# EAGLE design transmitter (EAGLE 7.7.0)
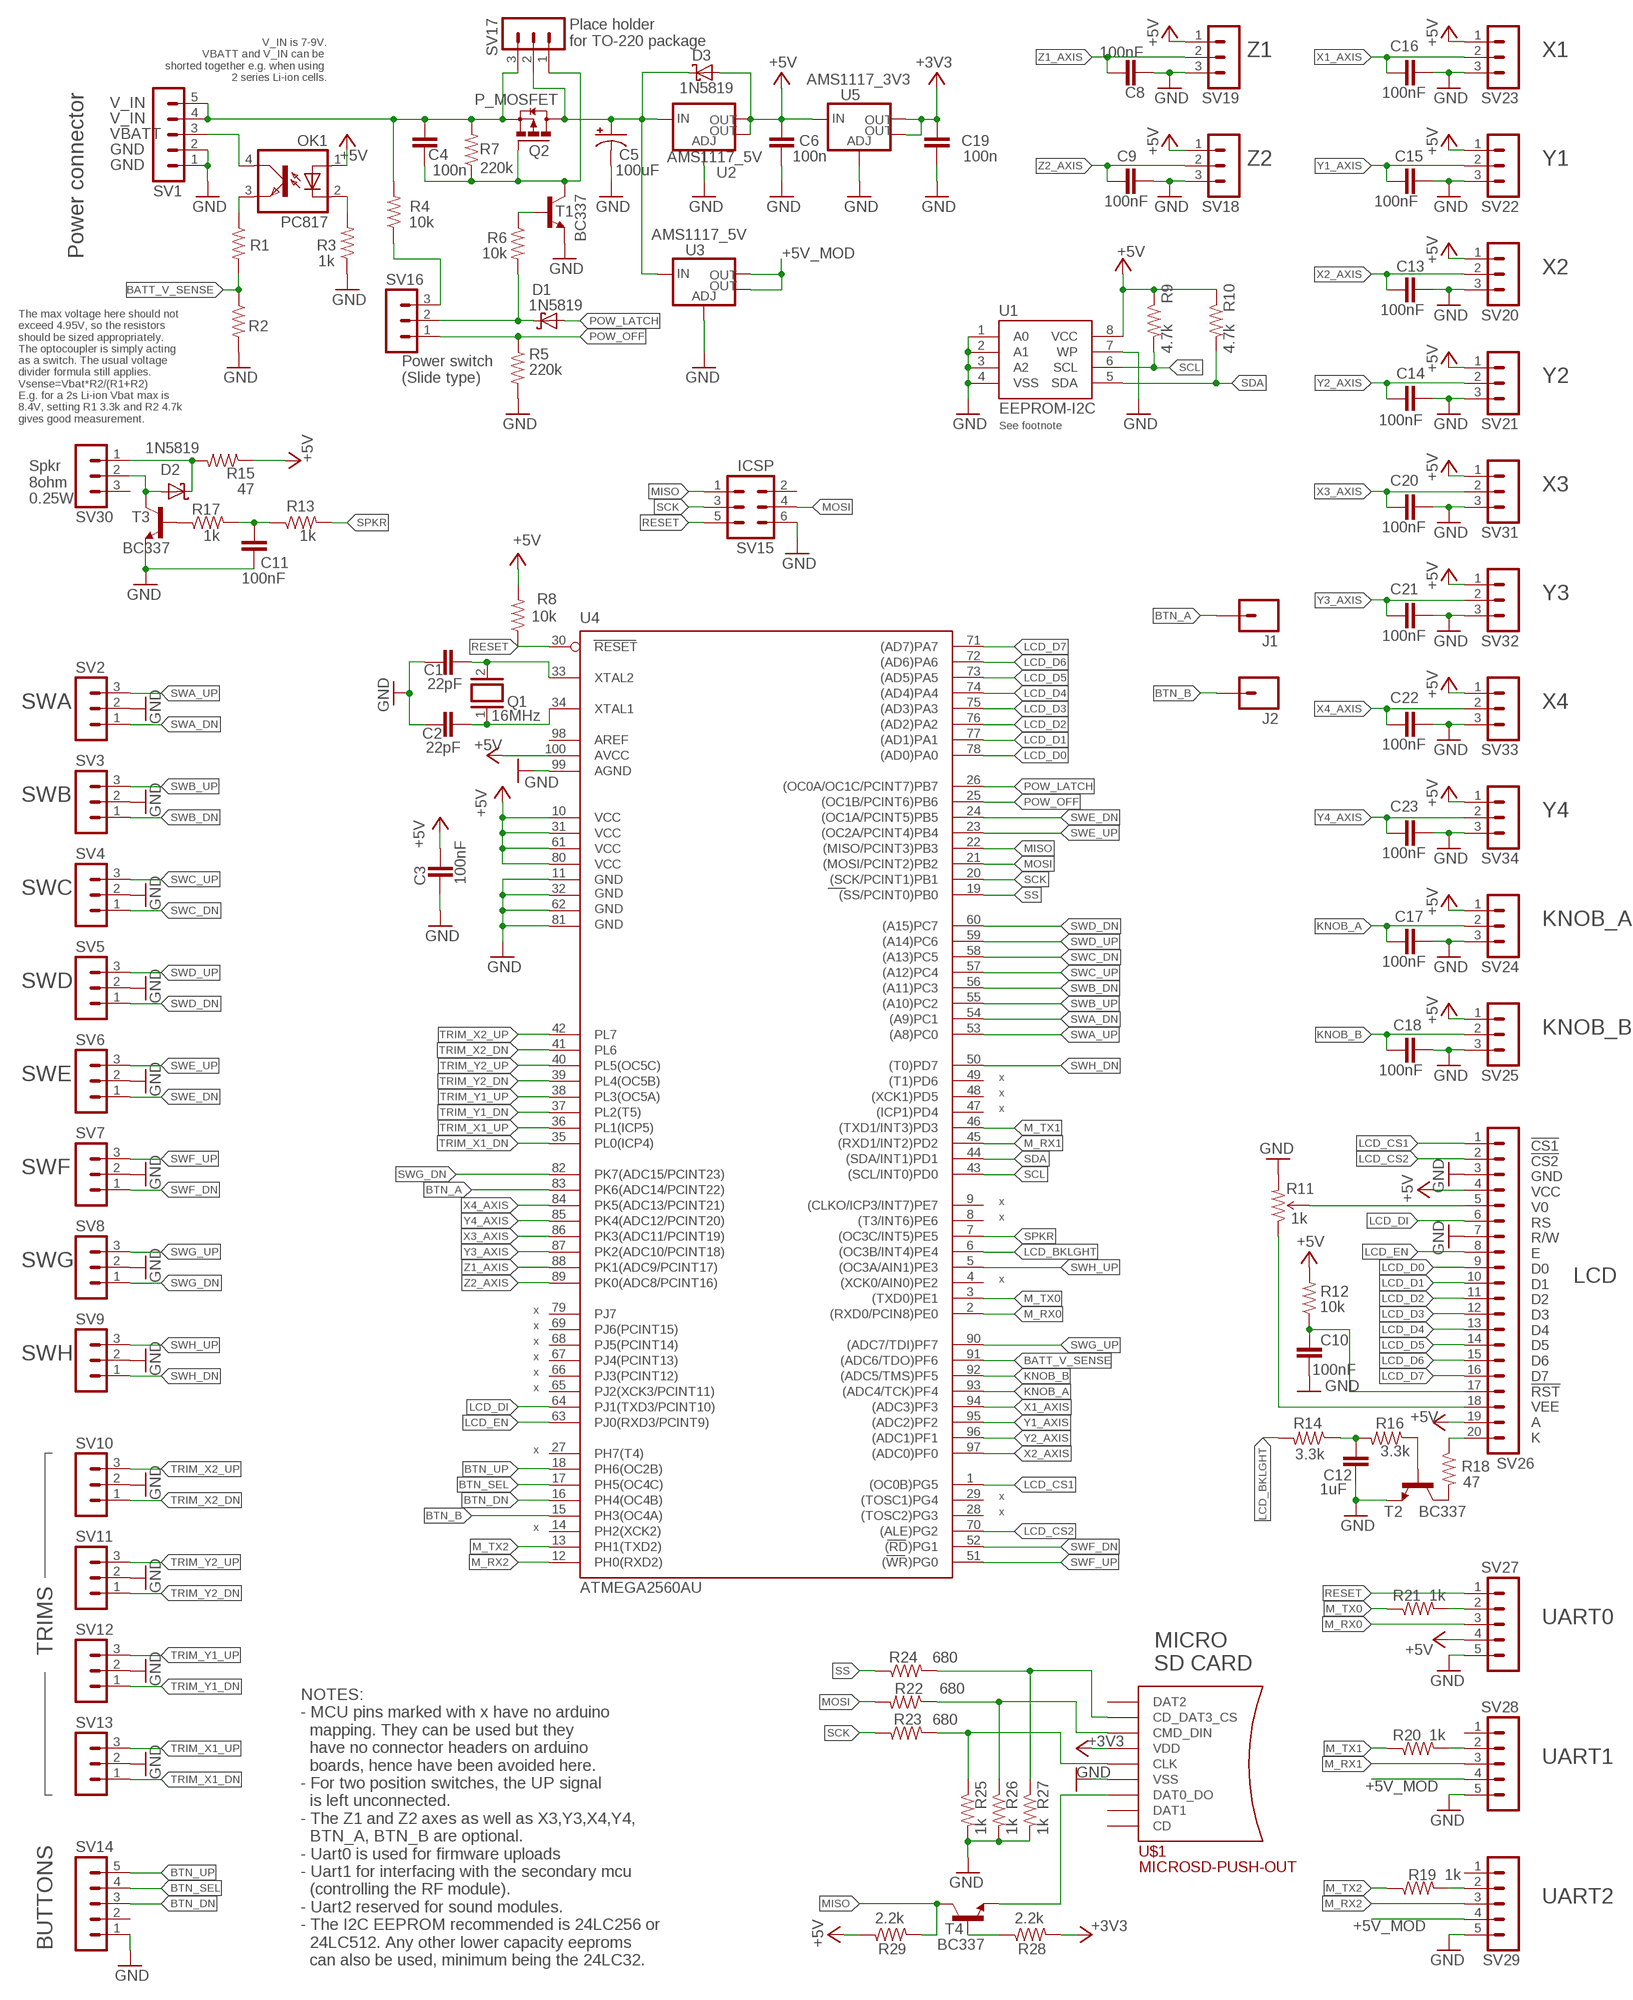
[diagram p0: schematic, sheet 1]

## Parts
C1  22pF  C-EU050-024X044  [C050-024X044]
C2  22pF  C-EU050-024X044  [C050-024X044]
C3  100nF  C-EU050-024X044  [C050-024X044]
C4  100n  C-EU050-024X044  [C050-024X044]
C5  100uF  CPOL-USE2,5-6E  [E2,5-6E]
C6  100n  C-EU050-024X044  [C050-024X044]
C8  100nF  C-EU050-024X044  [C050-024X044]
C9  100nF  C-EU050-024X044  [C050-024X044]
C10  100nF  C-EU050-024X044  [C050-024X044]
C11  100nF  C-EU050-024X044  [C050-024X044]
C12  1uF  C-EU050-024X044  [C050-024X044]
C13  100nF  C-EU050-024X044  [C050-024X044]
C14  100nF  C-EU050-024X044  [C050-024X044]
C15  100nF  C-EU050-024X044  [C050-024X044]
C16  100nF  C-EU050-024X044  [C050-024X044]
C17  100nF  C-EU050-024X044  [C050-024X044]
C18  100nF  C-EU050-024X044  [C050-024X044]
C19  100n  C-EU050-024X044  [C050-024X044]
C20  100nF  C-EU050-024X044  [C050-024X044]
C21  100nF  C-EU050-024X044  [C050-024X044]
C22  100nF  C-EU050-024X044  [C050-024X044]
C23  100nF  C-EU050-024X044  [C050-024X044]
D1  1N5819  1N5817-B  [DO41-7.6]
D2  1N5819  1N5817-B  [DO41-7.6]
D3  1N5819  1N5817-B  [DO41-7.6]
J1  M01PTH_LONGPAD  [1X01_LONGPAD]
J2  M01PTH_LONGPAD  [1X01_LONGPAD]
OK1  PC817  [DIL04]
Q1  16MHz  XTAL/S  [QS]
Q2  P_MOSFET  FDN360P  [SUPER-SOT3]
R1  1k  R-US_0204/5  [0204/5]
R2  1k  R-US_0204/5  [0204/5]
R3  1k  R-US_0204/5  [0204/5]
R4  10k  R-US_0204/5  [0204/5]
R5  220k  R-US_0204/5  [0204/5]
R6  10k  R-US_0204/5  [0204/5]
R7  220k  R-US_0204/5  [0204/5]
R8  10k  R-US_0204/5  [0204/5]
R9  4.7k  R-US_0204/5  [0204/5]
R10  4.7k  R-US_0204/5  [0204/5]
R11  1k  TRIMPOTPTH  [TRIM_POT_PTH]
R12  10k  R-US_0204/5  [0204/5]
R13  1k  R-US_0204/5  [0204/5]
R14  3.3k  R-US_0204/5  [0204/5]
R15  47  R-US_0204/5  [0204/5]
R16  3.3k  R-US_0204/5  [0204/5]
R17  1k  R-US_0204/5  [0204/5]
R18  47  R-US_0204/5  [0204/5]
R19  1k  R-US_0204/5  [0204/5]
R20  1k  R-US_0204/5  [0204/5]
R21  1k  R-US_0204/5  [0204/5]
R22  680  R-US_0204/5  [0204/5]
R23  680  R-US_0204/5  [0204/5]
R24  680  R-US_0204/5  [0204/5]
R25  1k  R-US_0204/5  [0204/5]
R26  1k  R-US_0204/5  [0204/5]
R27  1k  R-US_0204/5  [0204/5]
R28  2.2k  R-US_0204/5  [0204/5]
R29  2.2k  R-US_0204/5  [0204/5]
SV1  MA05-1  [MA05-1]
SV2  MA03-1  [MA03-1]
SV3  MA03-1  [MA03-1]
SV4  MA03-1  [MA03-1]
SV5  MA03-1  [MA03-1]
SV6  MA03-1  [MA03-1]
SV7  MA03-1  [MA03-1]
SV8  MA03-1  [MA03-1]
SV9  MA03-1  [MA03-1]
SV10  MA03-1  [MA03-1]
SV11  MA03-1  [MA03-1]
SV12  MA03-1  [MA03-1]
SV13  MA03-1  [MA03-1]
SV14  MA05-1  [MA05-1]
SV15  ICSP  MA03-2  [MA03-2]
SV16  MA03-1  [MA03-1]
SV17  MA03-1  [MA03-1]
SV18  MA03-1  [MA03-1]
SV19  MA03-1  [MA03-1]
SV20  MA03-1  [MA03-1]
SV21  MA03-1  [MA03-1]
SV22  MA03-1  [MA03-1]
SV23  MA03-1  [MA03-1]
SV24  MA03-1  [MA03-1]
SV25  MA03-1  [MA03-1]
SV26  MA20-1  [MA20-1]
SV27  MA05-1  [MA05-1]
SV28  MA05-1  [MA05-1]
SV29  MA05-1  [MA05-1]
SV30  MA03-1  [MA03-1]
SV31  MA03-1  [MA03-1]
SV32  MA03-1  [MA03-1]
SV33  MA03-1  [MA03-1]
SV34  MA03-1  [MA03-1]
T1  BC337  [TO92]
T2  BC337  [TO92]
T3  BC337  [TO92]
T4  BC337  [TO92]
U1  EEPROM-I2C  EEPROM-I2CEIAJ  [SO08-EIAJ]
U2  AMS1117_5V  V_REG_LM1117SOT223  [SOT223]
U3  AMS1117_5V  V_REG_LM1117SOT223  [SOT223]
U4  ATMEGA2560AU  [TQFP100]
U5  AMS1117_3V3  V_REG_LM1117SOT223  [SOT223]
U$1  MICROSD-PUSH-OUT  [MICROSD-PUSH-OUT]

## Nets
+3V3: C19.2 R28.2 U5.2(OUT) U5.4(OUT) U$1.4(VDD)
+5V: C3.1 C6.2 D3.A OK1.1(A) R8.2 R9.1 R10.1 R12.2 R15.1 R29.1 SV18.1 SV19.1 SV20.1 SV21.1 SV22.1 SV23.1 SV24.1 SV25.1 SV26.4 SV26.19 SV27.4 SV31.1 SV32.1 SV33.1 SV34.1 U1.8(VCC) U2.2(OUT) U2.4(OUT) U4.10(VCC) U4.31(VCC1) U4.61(VCC2) U4.80(VCC3) U4.100(AVCC) U5.3(IN)
+5V_MOD: SV28.4 SV29.4 U3.2(OUT) U3.4(OUT)
BATT_V_SENSE: R1.2 R2.1 U4.91((ADC6/TDO)PF6)
BTN_A: J1.1 U4.83(PK6(ADC14/PCINT22))
BTN_B: J2.1 U4.15(PH3(OC4A))
BTN_DN: SV14.3 U4.16(PH4(OC4B))
BTN_SEL: SV14.4 U4.17(PH5(OC4C))
BTN_UP: SV14.5 U4.18(PH6(OC2B))
GND: C1.1 C2.1 C3.2 C5.- C6.1 C8.2 C9.1 C10.2 C11.2 C12.2 C13.1 C14.1 C15.1 C16.1 C17.1 C18.1 C19.1 C20.1 C21.1 C22.1 C23.1 R2.2 R3.1 R5.2 R11.3(CW) R25.2 R26.2 R27.2 SV1.1 SV1.2 SV2.2 SV3.2 SV4.2 SV5.2 SV6.2 SV7.2 SV8.2 SV9.2 SV10.2 SV11.2 SV12.2 SV13.2 SV14.1 SV15.6 SV18.3 SV19.3 SV20.3 SV21.3 SV22.3 SV23.3 SV24.3 SV25.3 SV26.3 SV26.7 SV27.5 SV28.5 SV29.5 SV31.3 SV32.3 SV33.3 SV34.3 T1.1(E) T2.1(E) T3.1(E) U1.1(A0) U1.2(A1) U1.3(A2) U1.4(VSS) U1.7(WP) U2.1(ADJ) U3.1(ADJ) U4.11(GND) U4.32(GND1) U4.62(GND2) U4.81(GND3) U4.99(AGND) U5.1(ADJ) U$1.6(VSS) U$1.G1(VSS) U$1.G2(VSS) U$1.G3(VSS) U$1.G4(VSS)
KNOB_A: C17.2 SV24.2 U4.93((ADC4/TCK)PF4)
KNOB_B: C18.2 SV25.2 U4.92((ADC5/TMS)PF5)
LCD_BKLGHT: R14.2 U4.6((OC3B/INT4)PE4)
LCD_CS1: SV26.1 U4.1((OC0B)PG5)
LCD_CS2: SV26.2 U4.70((ALE)PG2)
LCD_D0: SV26.9 U4.78((AD0)PA0)
LCD_D1: SV26.10 U4.77((AD1)PA1)
LCD_D2: SV26.11 U4.76((AD2)PA2)
LCD_D3: SV26.12 U4.75((AD3)PA3)
LCD_D4: SV26.13 U4.74((AD4)PA4)
LCD_D5: SV26.14 U4.73((AD5)PA5)
LCD_D6: SV26.15 U4.72((AD6)PA6)
LCD_D7: SV26.16 U4.71((AD7)PA7)
LCD_DI: SV26.6 U4.64(PJ1(TXD3/PCINT10))
LCD_EN: SV26.8 U4.63(PJ0(RXD3/PCINT9))
M_RX0: SV27.3 U4.2((RXD0/PCIN8)PE0)
M_RX1: SV28.3 U4.45((RXD1/INT2)PD2)
M_RX2: SV29.3 U4.12(PH0(RXD2))
M_TX0: R21.1 U4.3((TXD0)PE1)
M_TX1: R20.1 U4.46((TXD1/INT3)PD3)
M_TX2: R19.1 U4.13(PH1(TXD2))
MISO: R29.2 SV15.1 T4.3(C) U4.22((MISO/PCINT3)PB3)
MOSI: R22.2 SV15.4 U4.21((MOSI/PCINT2)PB2)
N$1: C12.1 R14.1 R16.2
N$2: C10.1 R12.1 SV26.17
N$3: R18.2 T2.3(C)
N$4: R16.1 T2.2(B)
N$5: C11.1 R13.1 R17.2
N$6: R21.2 SV27.2
N$7: R20.2 SV28.2
N$8: R19.2 SV29.2
N$9: C1.2 Q1.2 U4.33(XTAL2)
N$10: C2.2 Q1.1 U4.34(XTAL1)
N$11: T4.1(E) U$1.7(DAT0_DO)
N$12: OK1.4(COL) SV1.3
N$13: R11.1(CCW) SV26.18
N$14: R11.2(WIPER) SV26.5
N$15: R18.1 SV26.20
N$16: R24.2 R27.1 U$1.2(CD_DAT3_CS)
N$17: R22.1 R26.1 U$1.3(CMD_DIN)
N$18: R23.2 R25.1 U$1.5(CLK)
N$19: R28.1 T4.2(B)
N$20: R17.1 T3.2(B)
N$21: D2.A SV30.2 T3.3(C)
N$22: D2.C R15.2 SV30.1
N$29: R6.1 T1.2(B)
N$30: D1.C R6.2 SV16.2
N$38: OK1.3(EMIT) R1.1
N$39: C4.2 Q2.2(S) R4.2 R7.2 SV1.4 SV1.5 SV17.3
N$43: C4.1 Q2.1(G) R7.1 SV17.1 T1.3(C)
N$44: OK1.2(C) R3.2
N$45: R4.1 SV16.3
N$47: C5.+ D3.C Q2.3(D) SV17.2 U2.3(IN) U3.3(IN)
POW_LATCH: D1.A U4.26((OC0A/OC1C/PCINT7)PB7)
POW_OFF: R5.1 SV16.1 U4.25((OC1B/PCINT6)PB6)
RESET: R8.1 SV15.5 SV27.1 U4.30(RESET)
SCK: R23.1 SV15.3 U4.20((SCK/PCINT1)PB1)
SCL: R9.2 U1.6(SCL) U4.43((SCL/INT0)PD0)
SDA: R10.2 U1.5(SDA) U4.44((SDA/INT1)PD1)
SPKR: R13.2 U4.7((OC3C/INT5)PE5)
SS: R24.1 U4.19((SS/PCINT0)PB0)
SWA_DN: SV2.1 U4.54((A9)PC1)
SWA_UP: SV2.3 U4.53((A8)PC0)
SWB_DN: SV3.1 U4.56((A11)PC3)
SWB_UP: SV3.3 U4.55((A10)PC2)
SWC_DN: SV4.1 U4.58((A13)PC5)
SWC_UP: SV4.3 U4.57((A12)PC4)
SWD_DN: SV5.1 U4.60((A15)PC7)
SWD_UP: SV5.3 U4.59((A14)PC6)
SWE_DN: SV6.1 U4.24((OC1A/PCINT5)PB5)
SWE_UP: SV6.3 U4.23((OC2A/PCINT4)PB4)
SWF_DN: SV7.1 U4.52((RD)PG1)
SWF_UP: SV7.3 U4.51((WR)PG0)
SWG_DN: SV8.1 U4.82(PK7(ADC15/PCINT23))
SWG_UP: SV8.3 U4.90((ADC7/TDI)PF7)
SWH_DN: SV9.1 U4.50((T0)PD7)
SWH_UP: SV9.3 U4.5((OC3A/AIN1)PE3)
TRIM_X1_DN: SV13.1 U4.35(PL0(ICP4))
TRIM_X1_UP: SV13.3 U4.36(PL1(ICP5))
TRIM_X2_DN: SV10.1 U4.41(PL6)
TRIM_X2_UP: SV10.3 U4.42(PL7)
TRIM_Y1_DN: SV12.1 U4.37(PL2(T5))
TRIM_Y1_UP: SV12.3 U4.38(PL3(OC5A))
TRIM_Y2_DN: SV11.1 U4.39(PL4(OC5B))
TRIM_Y2_UP: SV11.3 U4.40(PL5(OC5C))
X1_AXIS: C16.2 SV23.2 U4.94((ADC3)PF3)
X2_AXIS: C13.2 SV20.2 U4.97((ADC0)PF0)
X3_AXIS: C20.2 SV31.2 U4.86(PK3(ADC11/PCINT19))
X4_AXIS: C22.2 SV33.2 U4.84(PK5(ADC13/PCINT21))
Y1_AXIS: C15.2 SV22.2 U4.95((ADC2)PF2)
Y2_AXIS: C14.2 SV21.2 U4.96((ADC1)PF1)
Y3_AXIS: C21.2 SV32.2 U4.87(PK2(ADC10/PCINT18))
Y4_AXIS: C23.2 SV34.2 U4.85(PK4(ADC12/PCINT20))
Z1_AXIS: C8.1 SV19.2 U4.88(PK1(ADC9/PCINT17))
Z2_AXIS: C9.2 SV18.2 U4.89(PK0(ADC8/PCINT16))
Unconnected: SV14.2 SV15.2 SV28.1 SV29.1 SV30.3 U4.4((XCK0/AIN0)PE2) U4.8((T3/INT6)PE6) U4.9((CLKO/ICP3/INT7)PE7) U4.14(PH2(XCK2)) U4.27(PH7(T4)) U4.28((TOSC2)PG3) U4.29((TOSC1)PG4) U4.47((ICP1)PD4) U4.48((XCK1)PD5) U4.49((T1)PD6) U4.65(PJ2(XCK3/PCINT11)) U4.66(PJ3(PCINT12)) U4.67(PJ4(PCINT13)) U4.68(PJ5(PCINT14)) U4.69(PJ6(PCINT15)) U4.79(PJ7) U4.98(AREF) U$1.1(DAT2) U$1.8(DAT1) U$1.CD

## Notes on the sheet
- V_IN is 7-9V.
  VBATT and V_IN can be 
  shorted together e.g. when using 
  2 series Li-ion cells.
- Place holder
  for TO-220 package
- Z1 | X1
- V_IN
- V_IN
- VBATT
- GND
- Z2 | Y1
- GND
- Power connector
- X2
- Power switch
  (Slide type)
- Y2
- See footnote
- The max voltage here should not 
  exceed 4.95V, so the resistors
  should be sized appropriately.
  The optocoupler is simply acting
  as a switch. The usual voltage 
  divider formula still applies.
  Vsense=Vbat*R2/(R1+R2)
  E.g. for a 2s Li-ion Vbat max is
  8.4V, setting R1 3.3k and R2 4.7k
  gives good measurement.
- Spkr
  8ohm 
  0.25W
- X3
- Y3
- SWA | X4
- SWB
- Y4
- SWC
- KNOB_A
- SWD
- KNOB_B
- SWE | x
- x
- x
- SWF
- x
- x
- SWG
- x | LCD
- x
- x
- x
- SWH | x
- x
- x
- !CS1
  !CS2
  GND
  VCC
  V0
  RS
  R/W
  E
  D0
  D1
  D2
  D3
  D4
  D5
  D6
  D7
  !RST
  VEE
  A
  K
- x
- x
- x
- x
- UART0
- TRIMS
- MICRO 
  SD CARD
- UART1
- UART2
- BUTTONS
- NOTES:
  - MCU pins marked with x have no arduino
    mapping. They can be used but they
    have no connector headers on arduino
    boards, hence have been avoided here.
  - For two position switches, the UP signal
    is left unconnected.
  - The Z1 and Z2 axes as well as X3,Y3,X4,Y4, 
    BTN_A, BTN_B are optional.
  - Uart0 is used for firmware uploads
  - Uart1 for interfacing with the secondary mcu 
    (controlling the RF module).
  - Uart2 reserved for sound modules.
  - The I2C EEPROM recommended is 24LC256 or
    24LC512. Any other lower capacity eeproms
    can also be used, minimum being the 24LC32.

## Library data of the parts
C1-C4 C6 C8-C23 = rcl:C-EU: CAPACITOR, European symbol
C5 = rcl:CPOL-US: POLARIZED CAPACITOR, American symbol
D1-D3 = diode:1N581*: 1.0A SCHOTTKY BARRIER RECTIFIER Source: http://www.diodes.com/datasheets/ds23001.pdf
J1 J2 = SparkFun-Connectors:M01: Header 1 Standard 1-pin 0.1" header. Use with straight break away headers (SKU : PRT-00116), right angle break away headers (PRT-00553), swiss pins (PRT-00743), machine pins (PRT-00117), and female headers (PRT-00115). SMTSO-256-ET is a "flush mount" nut for a 4-40 screw. The older package used to be too tight, and did not allow it to sit properly thru the drill hit. The latest (0.165DIA) fits nice and snug.
OK1 = optocoupler:PC817: SHARP OPTO COUPLER; MPN: PC817X4J000F; OC_FARNELL: 9707727; OC_NEWARK: 97K7059
Q1 = special:XTAL/S: CRYSTAL
Q2 = transistor-power:FDN360P: Single P-Channel, PowerTrench (R) MOSFET Source: http://www.fairchildsemi.com/ds/FD/FDN360P.pdf
R1-R10 R13-R29 = rcl:R-US_: RESISTOR, American symbol
R11 = SparkFun-Electromechanical:TRIMPOT: Various small potentiometers for "set-and-forget" applications
R12 = resistor:R-US_: RESISTOR, American symbol
SV1 SV14 SV27-SV29 = con-lstb:MA05-1: PIN HEADER; OC_FARNELL: unknown; OC_NEWARK: unknown
SV2-SV13 SV16-SV25 SV30-SV34 = con-lstb:MA03-1: PIN HEADER; OC_FARNELL: unknown; OC_NEWARK: unknown
SV15 = con-lstb:MA03-2: PIN HEADER; OC_FARNELL: unknown; OC_NEWARK: unknown
SV26 = con-lstb:MA20-1: PIN HEADER; OC_FARNELL: unknown; OC_NEWARK: unknown
T1-T4 = transistor:BC337: NPN TRANSISTOR
U1 = SparkFun-DigitalIC:EEPROM-I2C: I2C EEPROM chips, 24LC256 (and others)
U2 U3 U5 = SparkFun-PowerIC:V_REG_LM1117: Voltage Regulator LM1117 Standard adjustable voltage regulator but in SMD form. Spark Fun Electronics SKU : COM-00595; PROD_ID: VREG-08170
U4 = SparkFun-DigitalIC:ATMEGA2560: Atmel 100-pin 8-bit uC 64/128/256 Kbytes FLASH 4 Kbytes EEPROM 8 Kbytes SRAM 86 General Purpose I/O pins 12-channels16-bit PWM 4 x Serial USARTs 16-channels 10-bit A/D; PROD_ID: IC-10040
U$1 = microsd:MICROSD-PUSH-OUT: T-Flash Push-Out Micro SD Card Reader 14.75mm x 14.5mm SMD with external pins

## Board
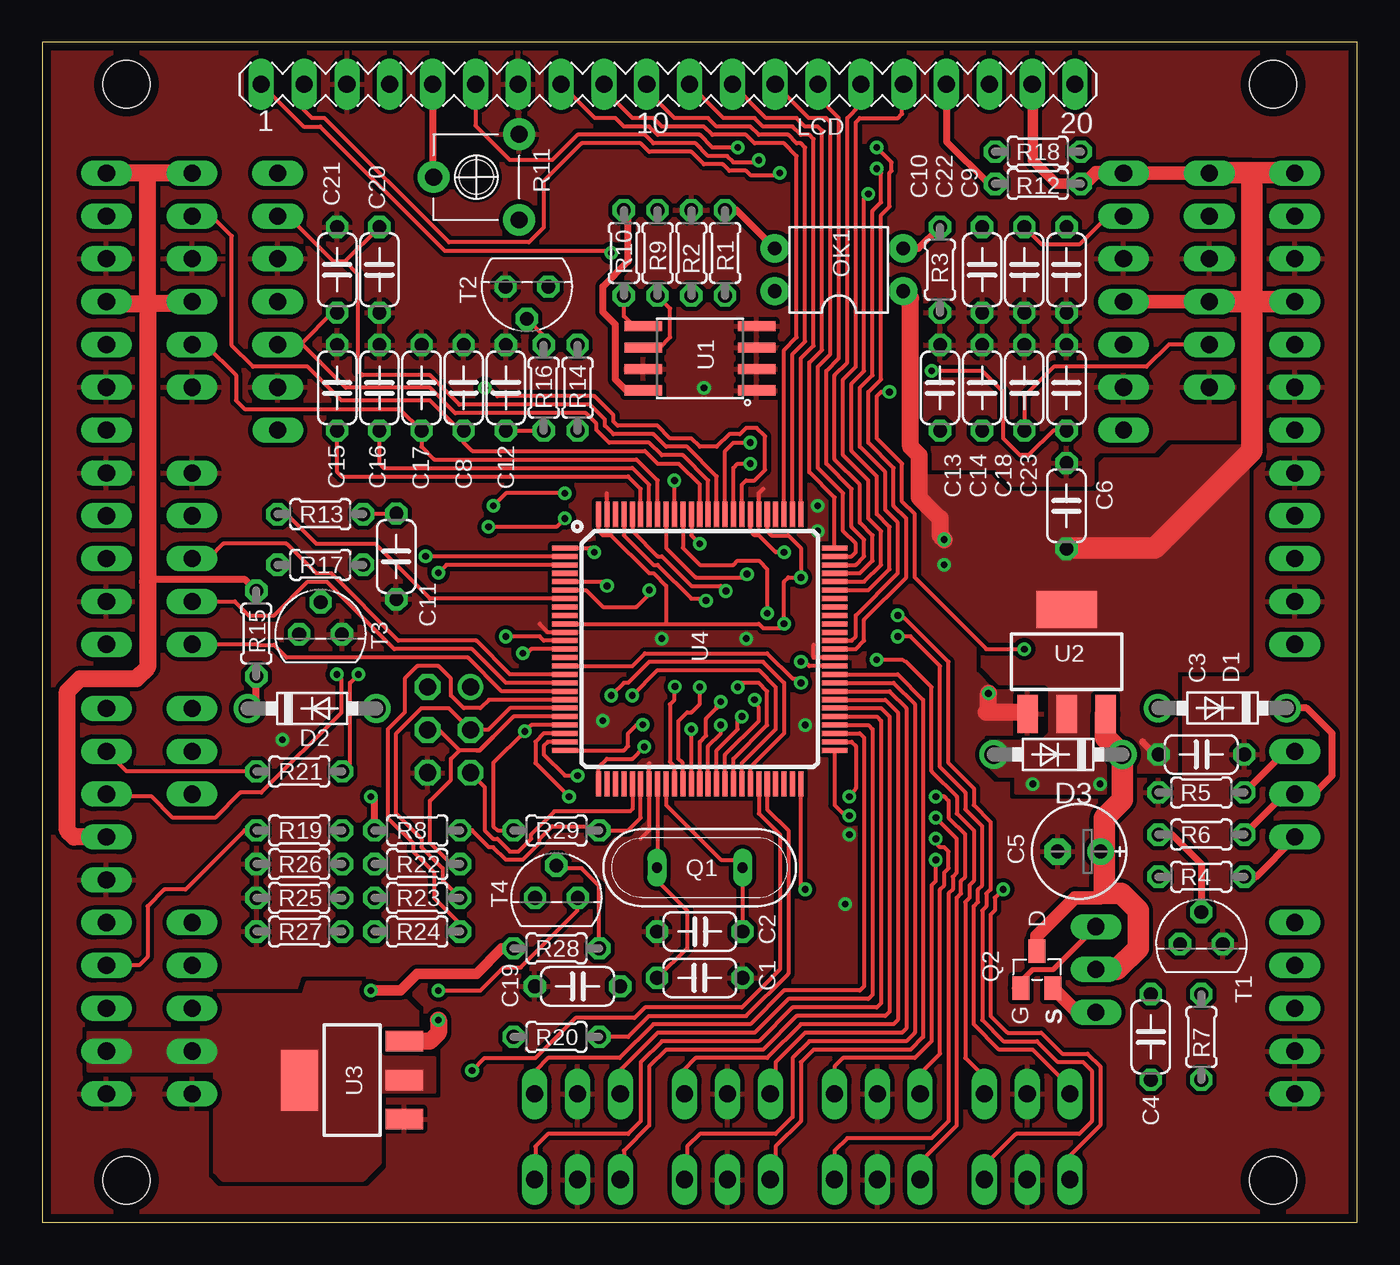
[diagram p1: board, top side]
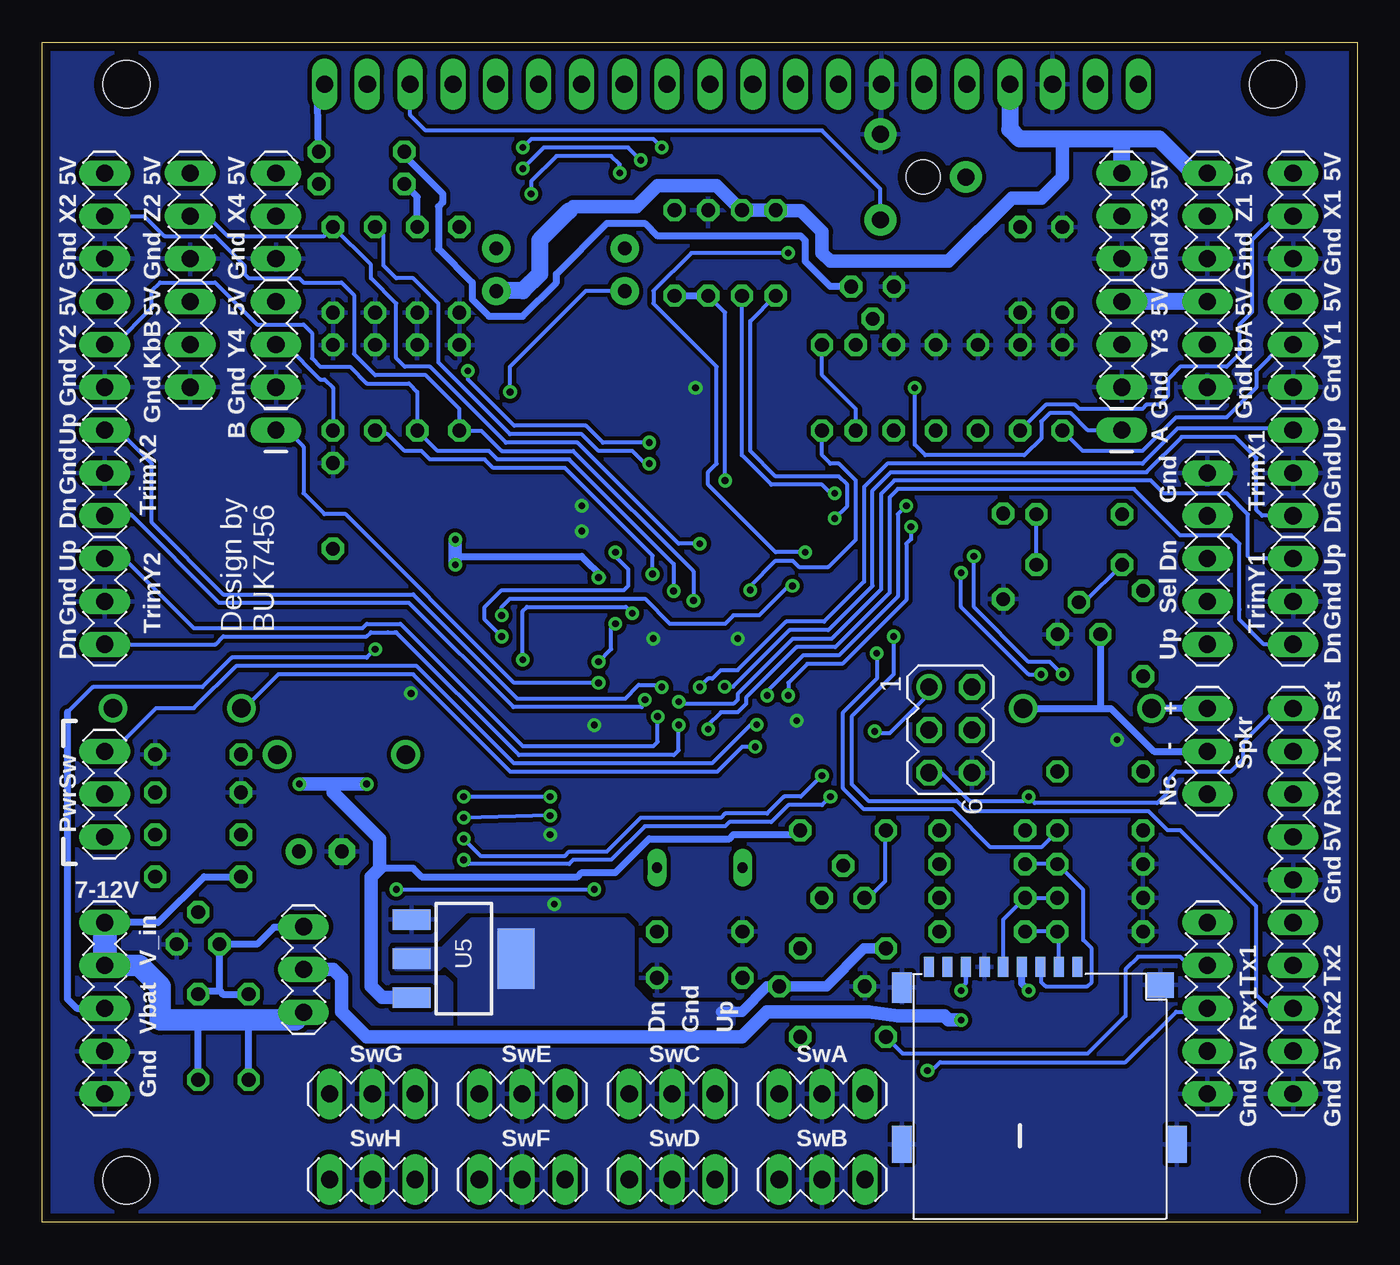
[diagram p2: board, bottom side, seen from below]

Size 78 x 70 mm. Coordinates in mm from the lower left corner, seen from the top.
Outline: 0,0 78,0 78,70 0,70 0,0
Copper layers (1*16): Top 0.035mm / dielectric 1.5mm / Bottom 0.035mm
Design rules "default *": minimum track width 0.25mm, minimum drill 0.4mm, track to track 0.25mm, track to pad 0.25mm, pad to pad 0.25mm, via to via 0.25mm, smd to smd 0.25mm, copper to edge 0.5mm, drill to drill 8mil, minimum pad ring 10mil, minimum via ring 8mil, stop-mask expansion 4mil, vias tented up to drill 0mil, thermal gap 10mil
Holes 2.8 mm at 5,2.5 73,2.5 5,67.5 73,67.5
Holes 2 mm at 25.75,62

### Footprints (pad centres in the part's own frame; a part is rotated, then mirrored left to right if it is on the bottom)
C050-024X044 = drill 0.813 octagon: 1 -2.54,0; 2 2.54,0
E2,5-6E = drill 0.813 pad 1.575: + -1.27,0 | drill 0.813 pad 1.575 octagon: - 1.27,0
DO41-7.6 = drill 1.1 pad 1.7: A 3.81,0; C -3.81,0
1X01_LONGPAD = drill 1 long: 1 0,0
DIL04 = drill 0.813 pad 1.676: 1 -1.27,-3.81; 2 1.27,-3.81; 3 1.27,3.81; 4 -1.27,3.81
QS = drill 0.61 long: 1 -2.54,0; 2 2.54,0
SUPER-SOT3 = smd 1 x 1.4: 1 -0.95,-1.1; 2 0.95,-1.1; 3 0,1.1
0204/5 = drill 0.813 octagon: 1 -2.54,0; 2 2.54,0
TRIM_POT_PTH = drill 1 pad 1.88: 1 -2.54,-2.54; 2 0,2.54; 3 2.54,-2.54
MA05-1 = drill 1.016 long: 1 -5.08,0; 2 -2.54,0; 3 0,0; 4 2.54,0; 5 5.08,0
MA03-1 = drill 1.016 long: 1 -2.54,0; 2 0,0; 3 2.54,0
MA03-2 = drill 1.016: 1 -2.54,-1.27 | drill 1.016 octagon: 2 -2.54,1.27; 3 0,-1.27; 4 0,1.27; 5 2.54,-1.27; 6 2.54,1.27
MA20-1 = drill 1.016 long: 1 -24.13,0; 2 -21.59,0; 3 -19.05,0; 4 -16.51,0; 5 -13.97,0; 6 -11.43,0; 7 -8.89,0; 8 -6.35,0; 9 -3.81,0; 10 -1.27,0; 11 1.27,0; 12 3.81,0; 13 6.35,0; 14 8.89,0; 15 11.43,0; 16 13.97,0; 17 16.51,0; 18 19.05,0; 19 21.59,0; 20 24.13,0
TO92 = drill 0.813 octagon: 1 1.27,0; 2 0,1.905; 3 -1.27,0
SO08-EIAJ = smd 0.61 x 2.21: 1 -1.905,-3.378; 2 -0.635,-3.378; 3 0.635,-3.378; 4 1.905,-3.378; 5 1.905,3.353; 6 0.635,3.353; 7 -0.635,3.353; 8 -1.905,3.353
SOT223 = smd 1.219 x 2.235: 1 -2.311,-3.099; 2 0,-3.099; 3 2.311,-3.099 | smd 3.6 x 2.2: 4 0,3.099
TQFP100 = smd 1.5 x 0.3: 1 -8,6; 2 -8,5.5; 3 -8,5; 4 -8,4.5; 5 -8,4; 6 -8,3.5; 7 -8,3; 8 -8,2.5; 9 -8,2; 10 -8,1.5; 11 -8,1; 12 -8,0.5; 13 -8,0; 14 -8,-0.5; 15 -8,-1; 16 -8,-1.5; 17 -8,-2; 18 -8,-2.5; 19 -8,-3; 20 -8,-3.5; 21 -8,-4; 22 -8,-4.5; 23 -8,-5; 24 -8,-5.5; 25 -8,-6; 51 8,-6; 52 8,-5.5; 53 8,-5; 54 8,-4.5; 55 8,-4; 56 8,-3.5; 57 8,-3; 58 8,-2.5; 59 8,-2; 60 8,-1.5; 61 8,-1; 62 8,-0.5; 63 8,0; 64 8,0.5; 65 8,1; 66 8,1.5; 67 8,2; 68 8,2.5; 69 8,3; 70 8,3.5; 71 8,4; 72 8,4.5; 73 8,5; 74 8,5.5; 75 8,6 | smd 0.3 x 1.5: 26 -6,-8; 27 -5.5,-8; 28 -5,-8; 29 -4.5,-8; 30 -4,-8; 31 -3.5,-8; 32 -3,-8; 33 -2.5,-8; 34 -2,-8; 35 -1.5,-8; 36 -1,-8; 37 -0.5,-8; 38 0,-8; 39 0.5,-8; 40 1,-8; 41 1.5,-8; 42 2,-8; 43 2.5,-8; 44 3,-8; 45 3.5,-8; 46 4,-8; 47 4.5,-8; 48 5,-8; 49 5.5,-8; 50 6,-8; 76 6,8; 77 5.5,8; 78 5,8; 79 4.5,8; 80 4,8; 81 3.5,8; 82 3,8; 83 2.5,8; 84 2,8; 85 1.5,8; 86 1,8; 87 0.5,8; 88 0,8; 89 -0.5,8; 90 -1,8; 91 -1.5,8; 92 -2,8; 93 -2.5,8; 94 -3,8; 95 -3.5,8; 96 -4,8; 97 -4.5,8; 98 -5,8; 99 -5.5,8; 100 -6,8
MICROSD-PUSH-OUT = smd 0.6 x 1.2: 1 9.625,0.425; 2 8.525,0.425; 3 7.425,0.425; 4 6.325,0.425; 5 5.225,0.425; 6 4.125,0.425; 7 3.025,0.425; 8 1.925,0.425; CD 0.825,0.425 | smd 1.2 x 1.8: G1 -0.775,-0.8 | smd 1.2 x 2.2: G2 -0.775,-10.1; G4 15.525,-10.1 | smd 1.6 x 1.5: G3 14.55,-0.65

### Placement (x,y rotation side)
C1  39,14.5 180 top
C2  39,17.25 0 top
C3  68.75,27.75 0 top
C4  65.75,11 270 top
C5  61.5,22 180 top
C6  60.75,42.5 270 top
C8  25,49.5 90 top
C9  60.75,56.5 90 top
C10  55.75,56.5 270 top
C11  21,39.5 270 top
C12  27.5,49.5 90 top
C13  53.25,49.5 270 top
C14  55.75,49.5 270 top
C15  17.5,49.5 270 top
C16  20,49.5 270 top
C17  22.5,49.5 270 top
C18  58.25,49.5 270 top
C19  31.75,14 0 top
C20  20,56.5 90 top
C21  17.5,56.5 270 top
C22  58.25,56.5 90 top
C23  60.75,49.5 270 top
D1  70,30.5 180 top
D2  16.01,30.48 0 top
D3  60.25,27.75 180 top
J1  13.97,46.99 90 bottom
J2  64.14,46.99 90 bottom
OK1  47.25,56.5 90 top
Q1  39,21.04 180 top
Q2  59,15 0 top
R1  40.5,57.5 270 top
R2  38.5,57.5 90 top
R3  53.25,56.5 90 top
R4  68.75,20.5 180 top
R5  68.75,25.5 180 top
R6  68.75,23 0 top
R7  68.75,11 270 top
R8  22.25,23.25 0 top
R9  36.5,57.5 270 top
R10  34.5,57.5 270 top
R11  25.75,62 90 top
R12  59.05,61.59 0 top
R13  16.5,42 180 top
R14  31.75,49.5 270 top
R15  12.7,34.92 270 top
R16  29.75,49.5 270 top
R17  16.5,39 0 top
R18  59.05,63.5 180 top
R19  15.25,23.25 180 top
R20  30.5,11 180 top
R21  15.25,26.75 180 top
R22  22.25,21.25 0 top
R23  22.25,19.25 180 top
R24  22.25,17.25 180 top
R25  15.25,19.25 180 top
R26  15.25,21.25 180 top
R27  15.25,17.25 180 top
R28  30.5,16.25 180 top
R29  30.5,23.25 180 top
SV1  74.3,12.7 90 bottom
SV2  31.75,7.62 0 bottom
SV3  31.75,2.54 0 bottom
SV4  40.64,7.62 0 bottom
SV5  40.64,2.54 0 bottom
SV6  49.53,7.62 0 bottom
SV7  49.53,2.54 0 bottom
SV8  58.42,7.62 0 bottom
SV9  58.42,2.54 0 bottom
SV10  74.3,44.45 90 bottom
SV11  74.3,36.83 90 bottom
SV12  3.81,36.83 90 bottom
SV13  3.81,44.45 90 bottom
SV14  8.89,39.37 270 bottom
SV15  24.13,29.21 270 bottom
SV16  74.3,25.4 270 bottom
SV17  62.5,15 270 bottom
SV18  69.22,59.69 270 bottom
SV19  8.89,59.69 270 bottom
SV20  74.3,59.69 270 bottom
SV21  74.3,52.07 270 bottom
SV22  3.81,52.07 270 bottom
SV23  3.81,59.69 270 bottom
SV24  8.89,52.07 270 bottom
SV25  69.22,52.07 270 bottom
SV26  37.12,67.5 0 top
SV27  3.81,25.4 270 bottom
SV28  8.89,12.7 270 bottom
SV29  3.81,12.7 270 bottom
SV30  8.89,27.94 270 bottom
SV31  13.97,59.69 270 bottom
SV32  13.97,52.07 270 bottom
SV33  64.14,59.69 270 bottom
SV34  64.14,52.07 270 bottom
T1  68.75,16.5 0 top
T2  28.75,55.5 180 top
T3  16.51,34.88 0 top
T4  30.5,19.25 0 top
U1  39,51.25 90 top
U2  60.75,33.25 0 top
U3  18.38,8.43 90 top
U4  39,34 0 top
U5  52.99,15.65 270 bottom
U$1  26.23,14.73 0 bottom

### Tracks (layer width: path | path; a pad name or v marks a point on that pad's centre or on a via)
+3V3  (via drill 0.4)
  Top 0.61: v19.5,13.75 21.25,13.75 22.25,14.75 25.75,14.75 27.25,16.25 R28.2
  Bottom 0.406: v19.5,13.75 19.91,14.15 U$1.4
  Bottom 0.61: 37.75,12.5 36.5,12.5 35,14 C19.2 31.5,14 29.25,16.25 R28.2
  pour Bottom (isolate 0.254, no thermals): 57,16.25 54.25,16.25 52.5,18 43.5,18 43,17.5 43,14 42,13 37.25,13 37,12.75 37,11.75 37.75,11 53,11 53.25,11.25 53.25,14.5 54,15.25 54.25,15.25 54.5,15 57,15
+5V  (via drill 0.4)
  Top 0.25: U4.10 37,35.5 | U4.100 33,41 33.25,40.75 33.75,40.75 36,38.5 36.25,38.5 37,37.75 37,35.5 | U4.31 35.5,24 34.75,23.25 R29.1 32.79,23.5 30.25,23.5 29.5,22.75 29.5,22.5 28.5,21.5 27.5,21.5 26.75,22.25 26.5,22.25 25.5,23.25 R8.2 24.79,23.21 | U4.61 45.5,33 45.25,33.25 v45,33.25 | U4.80 43,41 43.25,40.75 44.25,40.75 45,40 v45,38.25 44.25,38.25 44,38 v44,35.5 43.75,35.25 42.75,35.25 42.5,35.5 37,35.5
  Top 0.406: R15.1 12.04,38.12 6.38,38.12 6.25,38 | C3.1 66,27.75 65.25,28.5 | U1.8 34.66,49.34 34,50 34,53.25 33.25,54 33.25,55.5 34.75,57 34.75,59.79 R10.1
  Top 0.61: R12.2 60.16,61.59 58.75,63 58.75,67.47 SV26.19
  Top 0.813: SV34.1 SV25.1 | R12.2 61.84,61.59 62.5,62.25 64.11,62.25 SV33.1 SV18.1
  Top 1.016: v53.5,40.5 53.25,40.75 53.25,41.75 52,43 52,45.5 51.5,46 51.5,54.79 OK1.1 | SV27.4 1.89,22.86 1.5,23.25 1.5,31.5 2.25,32.25 5.58,32.25 6.25,32.92 6.25,38 6.25,54.5 | SV19.1 6.25,62.23 | 6.25,62.23 SV23.1 | SV22.1 3.81,54.5 6.25,54.5 | 6.25,54.5 6.25,62.23 | SV24.1 8.89,54.5 6.25,54.5
  Top 1.27: 71.75,54.5 71.75,45.75 66,40 60.79,40 C6.2 | 71.75,54.5 71.75,62.25 | 71.75,62.25 74.28,62.25 SV20.1 | 71.75,62.25 69.23,62.25 SV18.1 | SV21.1 71.86,54.61 71.75,54.5 | SV25.1 71.64,54.61 71.75,54.5
  Bottom 0.25: v45,33.25 44.25,34 44.25,35.25 v44,35.5
  Bottom 0.406: v45,38.25 44.75,38.25 46,39.5 53.25,39.5 53.5,39.75 | R29.1 33.29,23 37,23 37.25,22.75 42,22.75 44,20.75 46,20.75 46.25,20.5 55.5,20.5 56,21 58,21
  Bottom 0.813: v53.5,39 53.5,39.75 v53.5,40.5 | v62.75,26 60.75,26 | 60.75,26 v58.75,26 | U5.3 57.84,13.34 58.5,14 58.5,20.5 58,21 58,22.75 60.75,25.5 60.75,26 | 46.75,60 46.5,60.25 42.75,60.25 41.5,61.5 38,61.5 36.54,60.04 R9.1 R10.1 34.46,60 33,60 31.75,58.75 31.75,57.5 31.25,57 24.25,57 20.5,60.75 18.75,60.75 17.5,62 17.5,64 17.25,64.25
  Bottom 1.016: SV26.4 20.61,64.83 20.04,64.25 17.25,64.25 14,64.25 | SV19.1 9.73,62.23 11.75,64.25 14,64.25 | 46.75,60 48.5,58.25 48.5,56.25 49.5,55.25 51.04,55.25 OK1.1 | SV31.1 13.97,64.22 14,64.25 | SV24.1 SV32.1
  pour Top (isolate 0.254, no thermals): 57.75,25.5 63.25,25.5 63.25,26.75 67.25,26.75 67.25,32.75 71.25,32.75 71.5,33 71.5,45.75 71.25,46 67,46 66.25,45.25 63,45.25 62.75,45 62.75,43.5 62.5,43.25 57.25,43.25 56.25,44.25 52,44.25 52,38.5 55.75,34.75 55.75,33 56.75,32 59.5,32 59.75,31.75 59.75,29 59.25,28.5 56.25,28.5 56.25,27 56.75,26.5 57.75,26.5
+5V_MOD
  pour Top (isolate 0.254, no thermals): 22.25,9.75 23.25,9.75 23.25,7.75 20,7.75 20,3.5 19,2.5 10.75,2.5 10.25,3 10.25,9 2.75,9 2.75,11.25 9.5,11.25 9.5,13.5 15.5,13.5 15.75,14.25 20.5,14.25 22.25,12.5
BATT_V_SENSE  (via drill 0.4)
  Top 0.25: U4.91 v37.5,44
  Bottom 0.25: v37.5,44 37.5,53.96 R2.1
  Bottom 0.406: R1.2 R2.1
BTN_A  (via drill 0.4)
  Top 0.25: U4.83 41.5,43.75 41.75,44 42.25,44 42.88,44.62 42.88,46.62 42.38,47.12 41.75,47.12 41.38,46.75 40.75,46.75 40,46 39,46 38.5,46.5 37.25,46.5 36.5,47.25 34.12,47.25 33.88,47.5 33.88,47.88 32.75,49 27,49 26.5,49.5 v26.25,49.5
  Bottom 0.25: v26.25,49.5 26.25,46.12 25.62,45.5 19.75,45.5 18.75,46.5 18.75,47.5 18.25,48 17,48 16,47 J1.1
BTN_B  (via drill 0.4)
  Top 0.25: U4.15 35,33 35.75,33.75 43,33.75 44.5,32.25 44.75,32.25 v45,32
  Bottom 0.25: v45,32 50,32 60,42 61.25,42 62.5,43.25 62.5,46 63.5,47 64.12,47 J2.1
BTN_DN
  Top 0.25: U4.16 27.75,32.5 25.75,34.5 21.12,34.5 17.12,38.5 16.25,38.5 14.5,40.25 10.75,40.25 9.87,39.37 SV14.3
BTN_SEL
  Top 0.25: SV14.4 11.42,36.83 12.25,36 13.75,36 15.75,38 16.88,38 20.88,34 25.5,34 27.5,32 U4.17
BTN_UP
  Top 0.25: SV14.5 12.71,34.29 12.75,34.25 13.75,34.25 14.5,33.5 25.25,33.5 27.25,31.5 U4.18
GND  (via drill 0.4)
  Top 0.25: 36,27.25 U4.32 36,23.25 35.5,22.75 | U4.99 33.5,43.25 | U4.81 42.5,43.25 42.75,43.5 | U4.11 30,35 29.5,35.5 | 45.75,34.25 45.75,33.5 U4.62
  Top 1.016: U2.1 58.34,30.25 56,30.25 56.12,30.38 v56.12,31.38
  other vias: 36.75,34.62 39.25,49.5 46,41 41.75,34.62 33.25,29.75 47.62,18.88 47.88,23 46,42.5 45.25,29.5 14.25,28.62
  pour Top (isolate 0.25, rank 3): 0,70.5 78.5,70.5 78.5,-0.5 -0.5,-0.5 -0.5,70.5
  pour Bottom (rank 3): 0,70.48 78.74,70.48 78.74,-0.64 -0.64,-0.64 -0.64,70.48
KNOB_A
  Top 0.25: U4.93 36.5,44 35.25,45.25 23.25,45.25 22.5,46 C17.2 21.21,48.25 12,48.25 11.5,48.75 11.5,50.25 9.68,52.07 SV24.2
KNOB_B  (via drill 0.4)
  Top 0.25: U4.92 37,40 38.75,38.25 41.6,38.25 v41.8,38.45 | SV25.2 66.82,52.07 65.5,50.75 60,50.75 58.25,49 C18.2
  Bottom 0.25: v41.8,38.45 41.8,39.55 47,44.75 51.25,44.75 51.75,45.25 55,45.25 55.5,45.75 56.5,45.75 57.5,46.75 58.04,46.75 C18.2
LCD_BKLGHT  (via drill 0.4)
  Top 0.25: U4.6 32.25,37.5 33.25,36.5 35.25,36.5 36,37.25 v36,37.5
  Bottom 0.25: v36,37.5 36,37.75 34.5,39.25 33.5,39.25 33.12,38.88 31.38,38.88 29.75,40.5 29.75,44 30.75,45 31.25,45 31.75,45.5 R14.2
LCD_CS1  (via drill 0.4)
  Top 0.25: SV26.1 15.49,65 16.5,65 23.88,57.62 33.62,57.62 v33.75,57.5 | U4.1 32.5,40 v32.75,39.75
  Bottom 0.25: v32.75,39.75 34.5,39.75 38.5,43.75 38.5,44.5 38,45 38,50.75 41.75,54.5 41.75,55.25 39.5,57.5 v33.75,57.5
LCD_CS2  (via drill 0.4)
  Top 0.25: SV26.2 15.54,66.03 15.5,66 16,65.5 16.75,65.5 24.12,58.12 28.88,58.12 29.75,59 29.75,61.75 32,64 35.5,64 36,63.5 38.5,63.5 39.25,62.75 40.38,62.75 40.75,62.38 41.75,62.38 42,62.12 43.62,62.12 v43.75,62.25 | U4.70 49,37.5 50.25,38.75 50.25,41.25 49.5,42 49.5,44.25 48,45.75 48,49.75 48.75,50.5 48.75,60.75 v49,61
  Bottom 0.25: v43.75,62.25 43.75,62.75 44.25,63.25 47.5,63.25 49,61.75 v49,61
LCD_D0
  Top 0.25: U4.78 44,51.75 44.75,52.5 44.75,63.25 44,64 42.25,64 41.75,64.5 39.75,64.5 39.25,65 36.75,65 36.25,65.5 35,65.5 33.75,66.75 33.75,67.06 SV26.9
LCD_D1
  Top 0.25: U4.77 44.5,51.5 45.25,52.25 45.25,63.75 45,64 44.75,64 44.25,64.5 42.5,64.5 42,65 40,65 39.5,65.5 37.5,65.5 36,67 36,67.36 SV26.10
LCD_D2
  Top 0.25: U4.76 45,51.25 45.75,52 45.75,64.25 45.5,64.5 45,64.5 44.5,65 42.75,65 42.25,65.5 40.4,65.5 SV26.11
LCD_D3
  Top 0.25: U4.75 47,43 45.5,44.5 45.5,51 46.25,51.75 46.25,64.75 46,65 45.25,65 44.75,65.5 42.94,65.5 SV26.12
LCD_D4
  Top 0.25: U4.74 48,39.5 48.25,39.75 48.25,40.25 47.5,41 47.5,43.25 46,44.75 46,50.75 46.75,51.5 46.75,65.25 46.5,65.5 45.48,65.5 SV26.13
LCD_D5
  Top 0.25: U4.73 48.25,39 48.75,39.5 48.75,40.5 48,41.25 48,43.5 46.5,45 46.5,50.5 47.25,51.25 47.25,65.5 46,66.75 46,67.48 SV26.14
LCD_D6
  Top 0.25: U4.72 48.5,38.5 49.25,39.25 49.25,40.75 48.5,41.5 48.5,43.75 47,45.25 47,50.25 47.75,51 47.75,65.5 48.5,66.25 48.5,67.44 SV26.15
LCD_D7
  Top 0.25: U4.71 48.75,38 49.75,39 49.75,41 49,41.75 49,44 47.5,45.5 47.5,50 48.25,50.75 48.25,65.25 48.5,65.5 50.75,65.5 51,65.75 51,67.41 SV26.16
LCD_DI  (via drill 0.4)
  Top 0.25: SV26.6 25.7,65.06 27.75,63 30.25,63 31.75,64.5 35.75,64.5 36.25,64 38.75,64 39.5,63.25 40.62,63.25 41,62.88 42.38,62.88 v42.5,63 | U4.64 48,34.5 48.25,34.75 48.25,36 50.75,38.5 50.75,41.5 50,42.25 50,44.5 48.5,46 48.5,49.5 49.25,50.25 49.25,60 49.75,60.5 49.75,62.25 v49.5,62.5
  Bottom 0.25: v42.5,63 43.25,63.75 48.25,63.75 v49.5,62.5
LCD_EN  (via drill 0.4)
  Top 0.25: v41.25,63.75 39.75,63.75 39,64.5 36.5,64.5 36,65 34.5,65 34,65.5 32.77,65.5 SV26.8 | U4.63 48.25,34 48.75,34.5 48.75,35.75 51.25,38.25 51.25,41.75 50.5,42.5 50.5,44.75 49,46.25 49,49.25 49.75,50 49.75,59.75 50.25,60.25 50.25,62.25 50.38,62.38 50.38,62.88 v49.5,63.75
  Bottom 0.25: v41.25,63.75 41.75,64.25 49,64.25 v49.5,63.75
M_RX0  (via drill 0.4)
  Top 0.25: v22.74,39.51 23.01,39.49 23.02,39.5 U4.2 | v17.47,32.5 17.75,32.22 17.75,30.25 13,25.5 11.75,25.5 10.25,24 7.75,24 6.5,25.25 3.96,25.25 SV27.3
  Bottom 0.25: v17.47,32.5 17.5,32.5 18.25,33.25 19.5,33.25 22.74,36.49 v22.74,39.51 22.62,39.4
M_RX1  (via drill 0.4)
  Top 0.25: U4.45 42.5,24.25 43.75,23 43.75,15 41.5,12.75 35.75,12.75 35.12,12.12 31.62,12.12 29.25,9.75 26.25,9.75 v25.5,9
  Bottom 0.25: v25.5,9 25.25,9 24.75,9.5 13.75,9.5 10.75,12.5 9.09,12.5 SV28.3
M_RX2  (via drill 0.4 pad 0.61)
  Top 0.25: U4.12 29.75,34.5 29.5,34.75 v27.5,34.75
  Bottom 0.25: v27.5,34.75 27.5,32.5 30,30 30,26 29,25 23.75,25 23.12,24.38 12.38,24.38 11.25,23.25 10.5,23.25 6,18.75 6,13.5 5.25,12.75 3.86,12.75 SV29.3
M_TX0  (via drill 0.4)
  Top 0.25: v23.5,38.53 23.97,39 U4.3 | v18.75,32.5 18.25,32 18.25,27.21 R21.1
  Bottom 0.25: v23.5,38.53 23.5,36.5 19.5,32.5 v18.75,32.5
M_TX1
  Top 0.25: U4.46 43,24.5 44.25,23.25 44.25,14.75 41.75,12.25 36,12.25 34.75,11 R20.1
M_TX2  (via drill 0.4 pad 0.61)
  Top 0.25: U4.13 29,34 28.75,33.75 v28.5,33.75
  Bottom 0.25: v28.5,33.75 28.5,32.25 30.5,30.25 30.5,25.75 29.25,24.5 24,24.5 21.75,22.25 18.75,22.25 17.79,23.21 R19.1
MISO  (via drill 0.4)
  Top 0.25: U4.22 29,29.5 v28.62,29.12 26.75,27.25 26.75,23.5 27,23.25 R29.2
  Bottom 0.25: SV15.1 25.4,31.35 27.75,29 28.5,29 v28.62,29.12 | T4.3 29,19.25 28,20.25 28,23.21 R29.2
MOSI
  Top 0.25: 25.75,28 24.75,28 | U4.21 27.96,30 26.75,28.79 | 24.75,28 23.54,29.21 SV15.4 | 24.75,21.25 R22.2 24.25,21.25 23,22.5 23,25 24.25,26.25 24.25,27.5 24.75,28
  Top 0.254: 26.75,28.79 25.96,28 25.75,28
N$1
  Top 0.25: C12.1 R16.2
  Bottom 0.25: R16.2 29.75,48.25 31.75,50.25 R14.1
N$2
  Top 0.406: SV26.17 53.63,64.11 56.15,61.59 R12.1
  Bottom 0.406: C10.1 55.75,60.83 R12.1
N$3
  Bottom 0.406: T2.3 31.25,55.5 32.75,57 32.75,58.25 33,58.5 41.5,58.5 42.25,59.25 44.5,59.25 47.5,56.25 47.5,55.75 49.5,53.75 51.5,53.75 52.5,54.75 52.5,55.75 54.5,57.75 54.5,60.25 54.25,60.5 54.25,61 56.52,63.27 R18.2
N$4
  Top 0.25: T2.2 29.75,52.59 R16.1
N$5
  Top 0.25: C11.1 20.96,42 R13.1
  Bottom 0.25: R17.2 R13.1
N$6
  Top 0.25: R21.2 5,26.75 SV27.2
N$7
  Bottom 0.25: R20.2 26.96,10 16,10 13.75,12.25 13.75,15 13,15.75 10.5,15.75 9.99,15.24 SV28.2
N$8
  Top 0.25: R19.2 12,23.25 8.5,19.75 7.25,19.75 6.25,18.75 6.25,15.75 5.75,15.25 SV29.2
N$9
  Top 0.25: U4.33 36.5,21.08 Q1.2 36.46,20.29 38.25,18.5 38.25,16.25 C1.2
N$10
  Top 0.25: U4.34 37,24.75 40.25,21.5 41.08,21.5 Q1.1 C2.2
N$11  (via drill 0.4)
  Top 0.25: v23.5,13.75 26,13.75 27.38,15.12 28.38,15.12 31.75,18.5 31.75,19.23 T4.1
  Bottom 0.254: U$1.7 23.2,14.21 v23.5,13.75
N$12  (via drill 0.4)
  Top 0.25: v58.25,34 56,34 51.75,38.25 51.75,42 51,42.75 51,45 49.5,46.5 49.5,49 49.75,49.25 v50.25,49.25
  Bottom 0.25: v58.25,34 58.75,33.5 66.75,33.5 68.5,31.75 75,31.75 76.5,30.25 | v50.25,49.25 50.25,50.75 45.75,55.25 43.46,55.25 OK1.4
  Bottom 0.406: SV1.3 75.95,12.7 76.5,13.25 76.5,30.25
N$13
  Bottom 0.25: SV26.18 56.17,65.67 55.25,64.75 31.75,64.75 28.29,61.29 R11.1
N$14
  Top 0.406: SV26.5 23.16,62.05 R11.2
N$15
  Bottom 0.406: R18.1 61.7,67.94 SV26.20
N$16
  Bottom 0.25: R24.2 R27.1 17.7,17.16 U$1.2
N$17
  Bottom 0.25: R22.1 R26.1 16.25,19.71 16.25,16.75 15.75,16.25 15.75,14.25 16,14 18.5,14 18.75,14.25 18.75,15.1 U$1.3
N$18
  Bottom 0.25: U$1.5 21,17.96 R23.2 R25.1
N$19
  Top 0.25: R28.1 33.04,19.96 32,21 30.66,21 T4.2
N$20
  Bottom 0.25: R17.1 16.18,36.78 T3.2
N$21
  Bottom 0.406: D2.A 15.24,30.48 | 15.24,30.48 14.61,30.48 12.06,27.94 SV30.2 | T3.3 15.24,30.48
N$22
  Top 0.406: D2.C 12.7,30.98 R15.2
  Bottom 0.406: SV30.1 D2.C
N$29
  Top 0.406: T1.2 68.75,21.26 67.01,23 R6.1
N$30
  Top 0.406: D1.C 75,30.5 76.5,29 76.5,26.5 75.5,25.5 74.39,25.5 SV16.2 73.69,25.4 R6.2
N$38
  Top 0.406: OK1.3 41.17,60.04 R1.1
N$39
  Top 0.813: Q2.2 61.39,12.46 SV17.3
  Bottom 0.406: SV1.5 71.12,17.78 68.4,20.5 R4.2 | R7.2 68.75,12 | C4.2 65.75,12
  Bottom 1.27: SV1.4 72.24,15.24 71,14 71,12 68.75,12 65.75,12 62.96,12 SV17.3
  Bottom 1.422: SV1.5 SV1.4
N$43
  Top 0.305: Q2.1 57.65,13.9 58.75,15 59.96,15 SV17.1
  Bottom 0.406: SV17.1 62.54,17.5 64.25,17.5 65.25,16.5 T1.3 67.48,13.73 | C4.1 65.79,13.5 67.25,13.5 67.48,13.73 | R7.1 68.56,13.73 67.48,13.73
N$44
  Top 0.406: OK1.2 51.98,57.77 R3.2
N$45
  Top 0.406: R4.1 72,20.5 74.3,22.8 SV16.3
N$47  (via drill 0.4)
  Top 0.813: 63,19.5 62.75,19.25 61.25,19.25 59,17 Q2.3
  Top 1.016: v23.5,12 23.5,11.25 23,10.75 U3.3
  Top 1.27: SV17.2 63.75,15 65,16.25 65,18.5 64,19.5 63,19.5 63,21.77 C5.+ 63,22.23 63,24 64.06,25.06 D3.C 63.06,28.75 U2.3
  Bottom 0.813: v23.5,12 24.25,12 24.5,12.25 27.25,12.25 29,12.5 35,12.5 36.5,11 58.75,11 60.25,12.5 60.25,14.5 60.75,15 SV17.2
POW_LATCH  (via drill 0.4)
  Top 0.25: U4.26 33,27 33.5,27.5 35,27.5 v35.7,28.2
  Bottom 0.25: v35.7,28.2 36.49,28.2 37.97,26.72 50.22,26.72 56,32.5 64,32.5 66.02,30.48 D1.A
POW_OFF  (via drill 0.4)
  Top 0.25: U4.25 34.5,28 34.75,28.25 34.75,29 35.25,29.5 35.6,29.5 v35.62,29.52
  Top 0.406: R5.1 73.73,27.94 SV16.1
  Bottom 0.25: SV16.1 73.81,27.94 71.25,30.5 69,30.5 66.5,33 55.79,33 50.01,27.22 38.28,27.22 35.98,29.52 v35.62,29.52
RESET  (via drill 0.4)
  Top 0.25: U4.30 35,24.5 34.88,24.38 30.38,24.38 29,23 29,22.75 28.25,22 27.75,22 27,22.75 26.75,22.75 26.25,23.25 26.25,25.82 SV15.5
  Top 0.406: R8.1 19.71,25.04 v19.5,25.25
  Bottom 0.25: SV15.5 24.67,26.67 23,25 19.75,25 v19.5,25.25 19.12,24.88 11.88,24.88 11.25,25.5 11.25,26.25 10.75,26.75 7.5,26.75 6.75,27.5 6.75,28.5 4.75,30.5 3.83,30.5 SV27.1
SCK
  Top 0.25: U4.20 27.75,30.5 26.46,29.21 SV15.3 24.11,30.5 22.5,30.5 21,29 21,24.25 22.5,22.75 22.5,22.25 23.75,21 23.75,20.29 R23.1
SCL  (via drill 0.4)
  Top 0.25: v31,43.25 27.5,43.25 v26.75,42.5 | U4.43 41.5,27.25 43.5,29.25 43.5,31.75 42.5,32.75 36.5,32.75 v35,31.25 | U1.6 36.63,51.88 37.25,52.5 37.25,54.21 R9.2
  Bottom 0.25: v26.75,42.5 27.25,42 27.25,37.13 30.75,33.62 32.88,33.62 35,31.5 v35,31.25 | v31,43.25 31.25,43.25 31.75,43.75 34.75,43.75 36.5,45.5 R9.2
SDA  (via drill 0.4)
  Top 0.25: v31,41.75 30.5,41.25 v26.47,41.25 | U4.44 42,27 44,29 44,32 42.75,33.25 36,33.25 34.75,32 34.5,32 v33.75,31.25 | U1.5 35.09,53.16 34.5,53.75 R10.2
  Bottom 0.25: v26.47,41.25 26.47,40.53 26.75,40.25 26.75,36.92 30.55,33.12 32.62,33.12 33.75,32 v33.75,31.25 | v31,41.75 30.25,42.5 30.25,43.75 30.75,44.25 34.5,44.25 36,45.75 36,53.46 R10.2
SPKR
  Top 0.25: U4.7 23,37 19.75,40.25 16.25,40.25 14.5,42 R13.2
SS
  Top 0.25: U4.19 26.5,31 26,30.5 25,30.5 24.25,31.25 24.25,32.25 23.5,33 22.25,33 21.5,32.25 21.5,30.25 20.5,29.25 20.5,24 22,22.5 22,22 23.25,20.75 23.25,19.25 24.79,17.71 R24.1
SWA_DN
  Top 0.25: U4.54 49,29.5 49.25,29.25 49.25,13.5 49,13.25 44.25,13.25 42.25,11.25 36.5,11.25 34.25,9 34.25,7.66 SV2.1
SWA_UP
  Top 0.25: U4.53 48.5,29 48.75,28.75 48.75,14 48.5,13.75 44,13.75 42,11.75 36.25,11.75 34.25,9.75 30,9.75 29.25,9 29.25,7.66 SV2.3
SWB_DN
  Top 0.25: U4.56 49.75,30.5 50.25,30 50.25,12.5 50,12.25 44.75,12.25 42.75,10.25 37,10.25 36,9.25 36,5.75 34.5,4.25 34.5,2.75 SV3.1
SWB_UP
  Top 0.25: U4.55 49.5,30 49.75,29.75 49.75,13 49.5,12.75 44.5,12.75 42.5,10.75 36.75,10.75 35.5,9.5 35.5,6 34.75,5.25 30,5.25 29.25,4.5 29.25,2.58 SV3.3
SWC_DN
  Top 0.25: U4.58 50.25,31.5 51.25,30.5 51.25,11.5 51,11.25 45.25,11.25 43.5,9.5 43.5,7.94 SV4.1
SWC_UP
  Top 0.25: U4.57 50,31 50.75,30.25 50.75,12 50.5,11.75 45,11.75 43,9.75 38.75,9.75 38,9 38,7.72 SV4.3
SWD_DN
  Top 0.25: U4.60 50.75,32.5 52.25,31 52.25,11 51.5,10.25 45.75,10.25 45,9.5 45,6 43.5,4.5 43.5,2.86 SV5.1
SWD_UP
  Top 0.25: U4.59 50.5,32 51.75,30.75 51.75,11.25 51.25,10.75 45.5,10.75 44.5,9.75 44.5,6.25 43.5,5.25 39,5.25 38.25,4.5 38.25,2.69 SV5.3
SWE_DN  (via drill 0.4)
  Top 0.25: U4.24 30,28.5 29.75,28.25 29.75,27.75 31,26.5 v31.75,26.5 | v53,22.75 53,22.5 53.25,22.25 53.5,22.25 53.75,22 53.75,21 53.5,20.75 53.5,20 53.25,19.75 53.25,10 52,8.75 52,7.69 SV6.1
  Bottom 0.25: v31.75,26.5 33,25.25 34,25.25 35,24.25 37.5,24.25 37.75,24 42.5,24 44.5,22 46.75,22 47,21.75 52,21.75 v53,22.75
SWE_UP  (via drill 0.4)
  Top 0.25: U4.23 29.75,29 29.25,28.5 29.25,27.25 v31.25,25.25 | v53,21.5 53,20.25 52.75,20 52.75,10.75 51.75,9.75 47.5,9.75 47,9.25 SV6.3
  Bottom 0.25: v31.25,25.25 31.75,24.75 33.75,24.75 34.75,23.75 37.25,23.75 37.5,23.5 42.25,23.5 44.25,21.5 46.5,21.5 46.75,21.25 52.75,21.25 v53,21.5
SWF_DN  (via drill 0.4 pad 0.61)
  Top 0.25: U4.52 48,28.5 48.25,28.25 48.25,25.75 v47.88,25.25 | SV7.1 52.25,2.72 52.25,3.75 54.25,5.75 54.25,19.25 54.5,19.5 54.5,20.25 54.75,20.5 54.75,23 53.75,24 53.75,25 53.5,25.25 v53,25.25
  Bottom 0.25: v53,25.25 v47.88,25.25
SWF_UP  (via drill 0.4 pad 0.61)
  Top 0.25: U4.51 47,24.75 47.62,24.12 v47.88,24.12 | SV7.3 47,4.25 47.75,5 52.75,5 53.75,6 53.75,19.5 54,19.75 54,20.5 54.25,20.75 54.25,22.75 v53,24
  Bottom 0.25: v47.88,24.12 v53,24
SWG_DN  (via drill 0.4 pad 0.61)
  Top 0.25: v50.75,34.75 51.5,34.75 53.25,33 53.25,27 54.75,25.5 54.75,24.5 55.75,23.5 55.75,20 55.5,19.75 55.5,19 55.25,18.75 55.25,11.75 56.75,10.25 58.75,10.25 60.96,8.04 SV8.1 | v44,39.75 43.5,39.75 42.5,40.75 42.25,40.75 42,41 U4.82
  Bottom 0.25: v50.75,34.75 51.75,35.75 51.75,36.5 50.75,37.5 43.5,37.5 43.25,37.75 43.25,38.75 44,39.5 v44,39.75
SWG_UP  (via drill 0.4)
  Top 0.25: v49.5,33.38 51,33.38 51.25,33.25 52.75,31.75 52.75,26.75 54.25,25.25 54.25,24.25 55.25,23.25 55.25,20.25 55,20 55,19.25 54.75,19 54.75,9.75 55.88,8.62 SV8.3 | U4.90 38,40 39,39 41,39 41.25,39.25 42.5,39.25 43,38.75 v43,36.12
  Bottom 0.25: v49.5,33.38 49.5,36.25 49.25,36.5 43.38,36.5 v43,36.12
SWH_DN  (via drill 0.4, 0.4 pad 0.61)
  Top 0.25: v45.25,19.75 45,20 U4.50 | v57,19.75 56.5,19.25 56.5,18.5 56.25,18.25 56.25,12.25 57.25,11.25 59.25,11.25 60.5,10 62,10 62.75,9.25 62.75,5.75 60.75,3.75 60.75,2.75 SV9.1
  Bottom 0.25: v57,19.75 v45.25,19.75
SWH_UP  (via drill 0.4 pad 0.61)
  Top 0.25: v50.75,36 51,36 53.75,33.25 53.75,27.25 55.25,25.75 55.25,24.75 56.25,23.75 56.25,19.75 56,19.5 56,18.75 55.75,18.5 55.75,12 57,10.75 59,10.75 60.25,9.5 61.75,9.5 62.25,9 62.25,6 61.5,5.25 57.75,5.25 56,3.5 56,2.66 SV9.3 | U4.5 33.25,38 v33.5,37.75
  Bottom 0.25: v50.75,36 50.75,36.5 50.25,37 42.25,37 40.75,35.5 37.5,35.5 37,36 35.5,36 33.75,37.75 v33.5,37.75
TRIM_X1_DN  (via drill 0.4)
  Top 0.25: U4.35 37.5,27.04 37.22,27.32 37.22,30.72 37.5,31 37.5,31.75 v37.53,31.78
  Bottom 0.25: SV13.1 5.65,41.91 5.99,42.25 5.99,45.34 7.24,46.59 10.41,46.59 12.5,44.5 27.66,44.5 28.75,43.41 28.75,37.75 31.38,35.12 33.67,35.12 37.02,31.77 37.03,31.78 v37.53,31.78
TRIM_X1_UP  (via drill 0.4)
  Top 0.25: U4.36 38,27.25 37.72,27.53 37.72,29.72 38.25,30.25 38.5,30.25 39,30.75 v39,31.75
  Bottom 0.25: SV13.3 3.91,47.09 10.66,47.09 12.75,45 27.87,45 29.25,43.62 29.25,38 31.62,35.62 33.88,35.62 36.75,32.75 37.75,32.75 38.25,32.25 38.5,32.25 v39,31.75
TRIM_X2_DN  (via drill 0.4)
  Top 0.25: U4.41 40.5,27.75 42.5,29.75 42.5,30.5 v42.25,31
  Bottom 0.25: v42.25,31 42.44,30.56 50.06,30.56 56.25,36.75 67.5,36.75 72.75,42 74.2,42 SV10.1
TRIM_X2_UP  (via drill 0.4)
  Top 0.25: U4.42 41,27.5 43,29.5 43,31.5 42.5,32 41.5,32 v41.25,31.75
  Bottom 0.25: SV10.3 74.28,47 73.5,47 71.5,45 71.5,41.5 67.25,37.25 56,37.25 49.81,31.06 43.44,31.06 42.62,31.88 41.38,31.88 v41.25,31.75
TRIM_Y1_DN  (via drill 0.4)
  Top 0.25: U4.37 v38.5,29.25
  Bottom 0.25: SV12.1 5.54,34.29 7,35.75 7,36.35 6.99,36.36 7,36.37 7,40.25 7.5,40.75 10.5,40.75 13.25,43.5 27.25,43.5 27.75,43 27.75,37.34 30.96,34.12 33.25,34.12 36.25,31.13 36.25,30.75 36.75,30.25 37.75,30.25 38.5,29.5 v38.5,29.25
TRIM_Y1_UP  (via drill 0.4)
  Top 0.25: U4.38 39,28.5 39.38,28.88 39.38,29.88 40,30.5 40,30.62 v40.25,30.88
  Bottom 0.25: SV12.3 6.36,39.37 6.49,39.5 6.49,41.99 7.75,43.25 11.5,43.25 12.25,44 27.46,44 28.25,43.21 28.25,37.54 31.17,34.62 33.46,34.62 36.75,31.34 36.75,31 37,30.75 40.12,30.75 v40.25,30.88
TRIM_Y2_DN  (via drill 0.4)
  Top 0.25: U4.39 39.5,28.25 40.25,29 v40.25,29.5
  Bottom 0.25: v40.25,29.5 40.25,28 40.53,27.72 49.72,27.72 57,35 57.08,35 57.5,35 58.5,35 58.75,34.75 67.25,34.75 67.71,34.29 SV11.1
TRIM_Y2_UP  (via drill 0.4)
  Top 0.25: U4.40 40,28 41.25,29.25 41.25,29.75 v41.5,30
  Bottom 0.25: v41.5,30 41.5,28.5 41.75,28.25 49.5,28.25 56.75,35.5 58.75,35.5 59,35.25 69,35.25 73.12,39.37 SV11.3
X1_AXIS
  Top 0.25: U4.94 36,43.75 35,44.75 20.25,44.75 20,45 C16.2
  Bottom 0.25: C16.2 18.46,48.5 16.75,48.5 16.5,48.25 12.75,48.25 12.5,48.5 11.75,48.5 11.25,49 11.25,50 10.5,50.75 7.75,50.75 7,51.5 7,53.25 6.25,54 6.25,58.25 4.88,59.62 3.88,59.62 SV23.2
X2_AXIS  (via drill 0.4)
  Top 0.25: U4.97 34.5,40.75 36.25,39 36.5,39 38.5,37 39.25,37 v39.37,36.88
  Bottom 0.25: v39.37,36.88 39.37,38.62 46.5,45.75 50.75,45.75 51.96,46.96 C13.2 53.25,48.25 55.25,50.25 58.25,50.25 59.5,51.5 59.5,55 60.25,55.75 62.5,55.75 62.75,56 65.75,56 66,56.25 66,56.75 67.75,58.5 70.75,58.5 71.94,59.69 SV20.2
X3_AXIS
  Top 0.25: U4.86 40,44.25 38.25,46 37,46 36.25,46.75 33.88,46.75 33.38,47.25 33.38,47.62 32.5,48.5 24.75,48.5 23,50.25 19,50.25 18.75,50.5 18.75,56.21 17.96,57 | 17.96,57 17.25,57 15,59.25 14.41,59.25 SV31.2 | 17.96,57 C20.2
X4_AXIS  (via drill 0.4)
  Top 0.25: U4.84 41,44.75 41.25,45 v42,45 | C22.2 59.29,58 61.5,58 63.19,59.69 SV33.2
  Bottom 0.25: C22.2 57.75,58.54 57.75,56.75 57,56 56,56 54.5,54.5 54.5,51 50.25,46.75 46,46.75 45,45.75 43,45.75 42.25,45 v42,45
Y1_AXIS
  Top 0.25: U4.95 35.5,43.5 34.75,44.25 17.75,44.25 17.5,44.5 C15.2
  Bottom 0.25: 17.29,46.75 C15.2 16.29,45.75 12.75,45.75 10.75,47.75 7.75,47.75 6,49.5 6,50.5 4.5,52 3.88,52 SV22.2
Y2_AXIS  (via drill 0.4)
  Top 0.25: U4.96 35,41 36.5,39.5 36.75,39.5 38.5,37.75 40.25,37.75 v40.55,37.45
  Bottom 0.25: v40.55,37.45 40.55,39.05 46.75,45.25 51,45.25 51.5,45.75 54.54,45.75 C14.2 55.75,49.25 56.25,49.75 58.75,49.75 59.75,50.75 61.5,50.75 62,51.25 62,52.75 62.5,53.25 65.25,53.25 67.75,55.75 71,55.75 71.5,55.25 71.5,54.25 73.68,52.07 SV21.2
Y3_AXIS
  Top 0.25: U4.87 39.5,44 38,45.5 36.75,45.5 36,46.25 33.62,46.25 32.88,47 32.88,47.38 32.25,48 24.5,48 23,49.5 18,49.5 15.38,52.12 | C21.2 17.21,53.96 15.38,52.12 | 15.38,52.12 15.25,52 14.04,52 SV32.2
Y4_AXIS  (via drill 0.4)
  Top 0.25: C23.2 59.96,46.96 58.5,45.5 58,45.5 57,46.5 57,49.25 55.75,50.5 v52.75,50.5 | U4.85 40.5,45.75 41,46.25 v42,46.25
  Bottom 0.25: v52.75,50.5 52.75,50 50,47.25 45.75,47.25 44.75,46.25 v42,46.25 | C23.2 60.75,49.5 61.25,50 61.5,50 63.57,52.07 SV34.2
Z1_AXIS
  Top 0.25: U4.88 39,43.75 37.75,45 36.5,45 35.75,45.75 25.5,45.75 25,46.25 C8.1 24.79,46.96 23,48.75 17.75,48.75 15.75,50.75 12.5,50.75 11.25,52 11.25,58.5 10,59.75 8.95,59.75 SV19.2
Z2_AXIS  (via drill 0.4)
  Top 0.25: U4.89 38.5,40.75 v39,40.25
  Bottom 0.25: v39,40.25 40.25,40.25 46.25,46.25 50.5,46.25 55,50.75 56.5,50.75 57,51.25 57,54.5 58.5,56 58.5,56.79 C9.2 61.29,58.5 67,58.5 68.19,59.69 SV18.2

### Text on the board
bPlace: Design by / BUK7456 | Spkr
tNames: LCD | D | G | S
bNames: 5V | 5V | 5V | 5V | 5V | 5V | X1 | Z1 | X3 | X4 | Z2 | X2 | Gnd | Gnd | Gnd | Gnd | Gnd | Gnd | 5V | 5V | 5V | 5V | 5V | 5V | Y1 | KbA | KbB | Y3 | Y4 | Y2 | Gnd | Gnd | Gnd | Gnd | Gnd | Gnd | Up | B | Up | TrimX1 | A | TrimX2 | Gnd | Gnd | Gnd | Dn | Dn | Up | TrimY1 | Dn | TrimY2 | Up | Gnd | Sel | Gnd | Dn | Up | Dn | Rst | Tx0 | + | - | PwrSw | Rx0 | Nc | 5V | Gnd | 7-12V | V_in | Tx2 | Rx2 | Tx1 | Rx1 | Vbat | 5V | 5V | Dn / Gnd / Up | SwA | SwC | SwE | SwG | Gnd | Gnd | Gnd | SwB | SwD | SwF | SwH